# Altium schematic sheet Proximity Sensors.SchDoc: Title
size A4; Date: *******; ApprovedBy: *******; CheckedBy: Yasiru; Author: *******; CompanyName: *******; DrawnBy: Name; Engineer: *******; Organization: *******; Address1: *******; Address2: *******; Address3: *******; Address4: *******; DocumentNumber: Doc Num; Revision: *******; SheetNumber: 11; SheetTotal: 11; Subtitle: Proximity Sensors; Project: Resturant Robot; VersionRevision: III; TotalSheet: 11; CurrentTime: *******; CurrentDate: *******; Time: *******; DocumentFullPathAndName: *******; DocumentName: *******; ModifiedDate: *******; ImagePath: *******; ProjectName: *******; Application_BuildNumber: *******
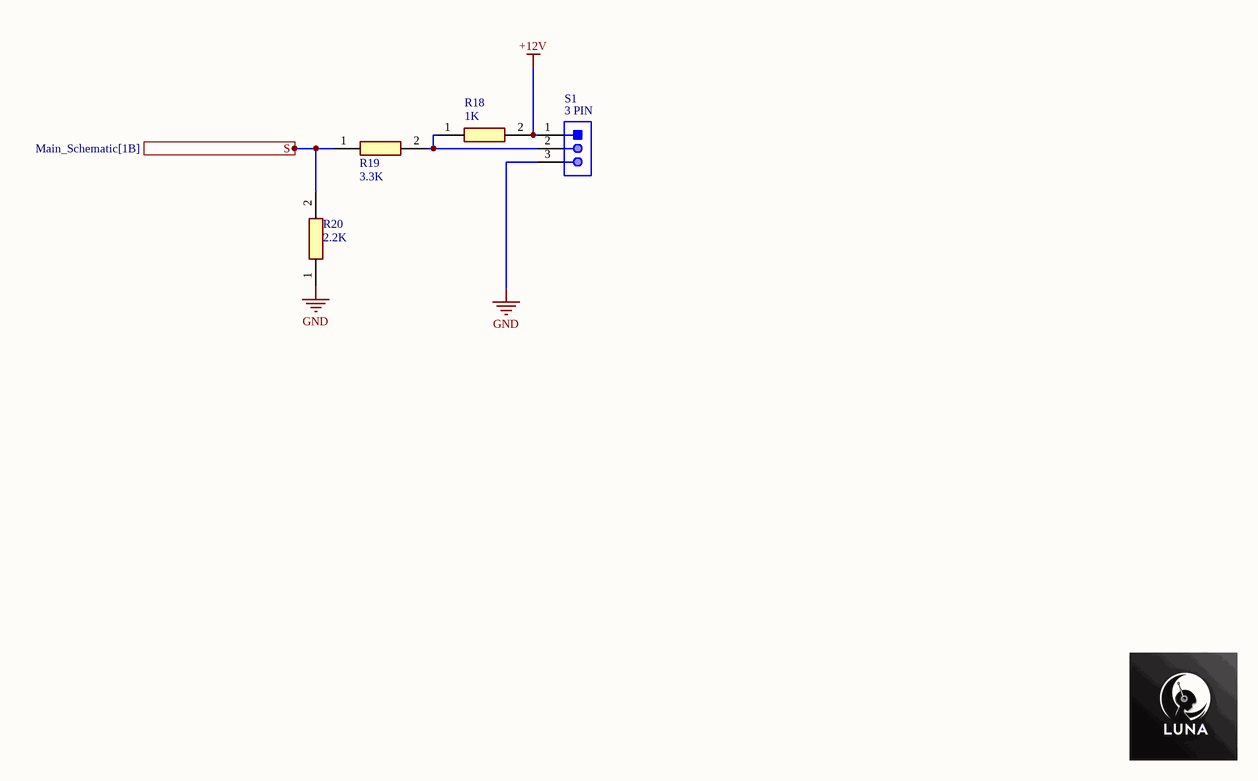
[diagram p0: Proximity Sensors.SchDoc]

## Parts
R18  1K  [RESC1608X55N]
R19  3.3K  [RESC1608X55N]
R20  2.2K  [ERJ3EKF1000V]
S1  3 PIN  [TECO-171825-3_V]

## Ports
S (see Main_Schematic[1B])

## Nets
+12V: R18.2 S1.1
GND: R20.1 S1.3
S: R19.1 R20.2 ; port S
NetR18_1: R18.1 R19.2 S1.2

## Notes on the sheet
- Title:
- Drawn By:
- Page Contents:
- Checked By:
- Subtitle:
- University Of Moratuwa
- Moratuwa
- Size:
- Date:
- File:
- Email:
- A4
- lasithnawanjaan123@gmail.com
- Lasith Haputhanthri
- Number:
- Time:
- Revision:
- Sheet
- of
- Katubedda
- 10500
- Sri Lanka

## Library data of the parts
R18 = RC0603FR-071KL: Resistor; Manufacturer_Name: YAGEO; Datasheet Link: https://www.yageo.com/upload/media/product/productsearch/datasheet/rchip/PYu-RC_Group_51_RoHS_L_12.pdf; Height: 0.55mm; Manufacturer_Part_Number: RC0603FR-071KL; Mouser Part Number: 603-RC0603FR-071KL; Mouser Price/Stock: https://www.mouser.co.uk/ProductDetail/YAGEO/RC0603FR-071KL?qs=VU8sRB4EgwApHsk4rF%2F3zg%3D%3D; Arrow Part Number: RC0603FR-071KL; Arrow Price/Stock: https://www.arrow.com/en/products/rc0603fr-071kl/yageo?region=nac
R19 = RMCF0603JT3K30: Resistor RMCF0603JT3K30; Manufacturer_Name: Stackpole Electronics; Datasheet Link: https://www.seielect.com/Catalog/SEI-RMCF_RMCP.pdf; Height: 0.55mm; Manufacturer_Part_Number: RMCF0603JT3K30
R20 = ERJ3GEYJ222V: Resistor; Manufacturer_Name: Panasonic; Datasheet Link: http://docs-europe.electrocomponents.com/webdocs/13ba/0900766b813ba21b.pdf; Height: 0.55mm; Manufacturer_Part_Number: ERJ3GEYJ222V; Arrow Part Number: ERJ3GEYJ222V; Arrow Price/Stock: https://www.arrow.com/en/products/erj-3geyj222v/panasonic?region=nac
S1 = CMP-2000-07494-1: Male Header, Pitch 2.5 mm, 1 x 3 Position, Height 10.4 mm, Tail Length 3.6 mm, / -20 to 95 degC / , RoHS, Bulk; Manufacturer: TE Connectivity; Mating Alignment: Yes(With); Tail Length: 0.142inch; Mating Post Length: 7.5mm; PCB Thickness: 0.063inch; PCB Mount Alignment: No(Without); Voltage Rating: 350V; Max Voltage Rating (AC): 250V; Plating Thickness: 0.8um; PCB Mounting Orientation: Vertical; Number of Positions: 3; PCB Mount Retention: Without; Max Current Rating: 3.5A; Max Voltage Rating (DC): 350.25kV; Pitch: 2.5mm; Approvals: UL; Contact Resistance: 20mOhm; Mount: ThroughHole; Length: 7.5mm; Orientation: Straight; Contact Mating Length: 0.295inch; Contact Material: Brass; Housing Material: Nylon; Package Description: Male Header, Pitch 2.5 mm, 1 x 3 Position, Height 10.4 mm, Tail Length 3.6 mm; Colour: Natural; Backwall/Post Interruptions: No(Without); Min Operating Temperature: -20degC; Mating Retention: Yes(With); Connector Type: Header; Packaging: Bag; RoHSCompliant: True; Package Reference: 171825-3; Contact Shape: Square; Strain Relief: No(Without); Contact Gender: Male; Number of Contacts: 3; Manufacturer URL: http://www.te.com/; Height: 0.409inch; Contact Retention: No(Without); Datasheet Version: Rev. Y3, 12/2016; Panel Mount Retention: No(Without); Datasheet URL: http://www.te.com/commerce/DocumentDelivery/DDEController?Action=showdoc&DocId=Customer+Drawing%7F171825%7FY3%7Fpdf%7FEnglish%7FENG_CD_171825_Y3.pdf%7F171825-3; Termination: Solder; Mounting Technology: ThroughHole; Max Operating Temperature: 95degC; Flammability Rating: UL94V-0; REACH SVHC: NoSVHC; Housing Colour: Natural; Package Quantity: 1000; Number of Rows: 1; Depth: 4.9mm; Contact Plating: Tin